# EAGLE schematic PowerSwitchingBoard (EAGLE 9.0.0)

## Sheet 1 of 6: Gimbal Control
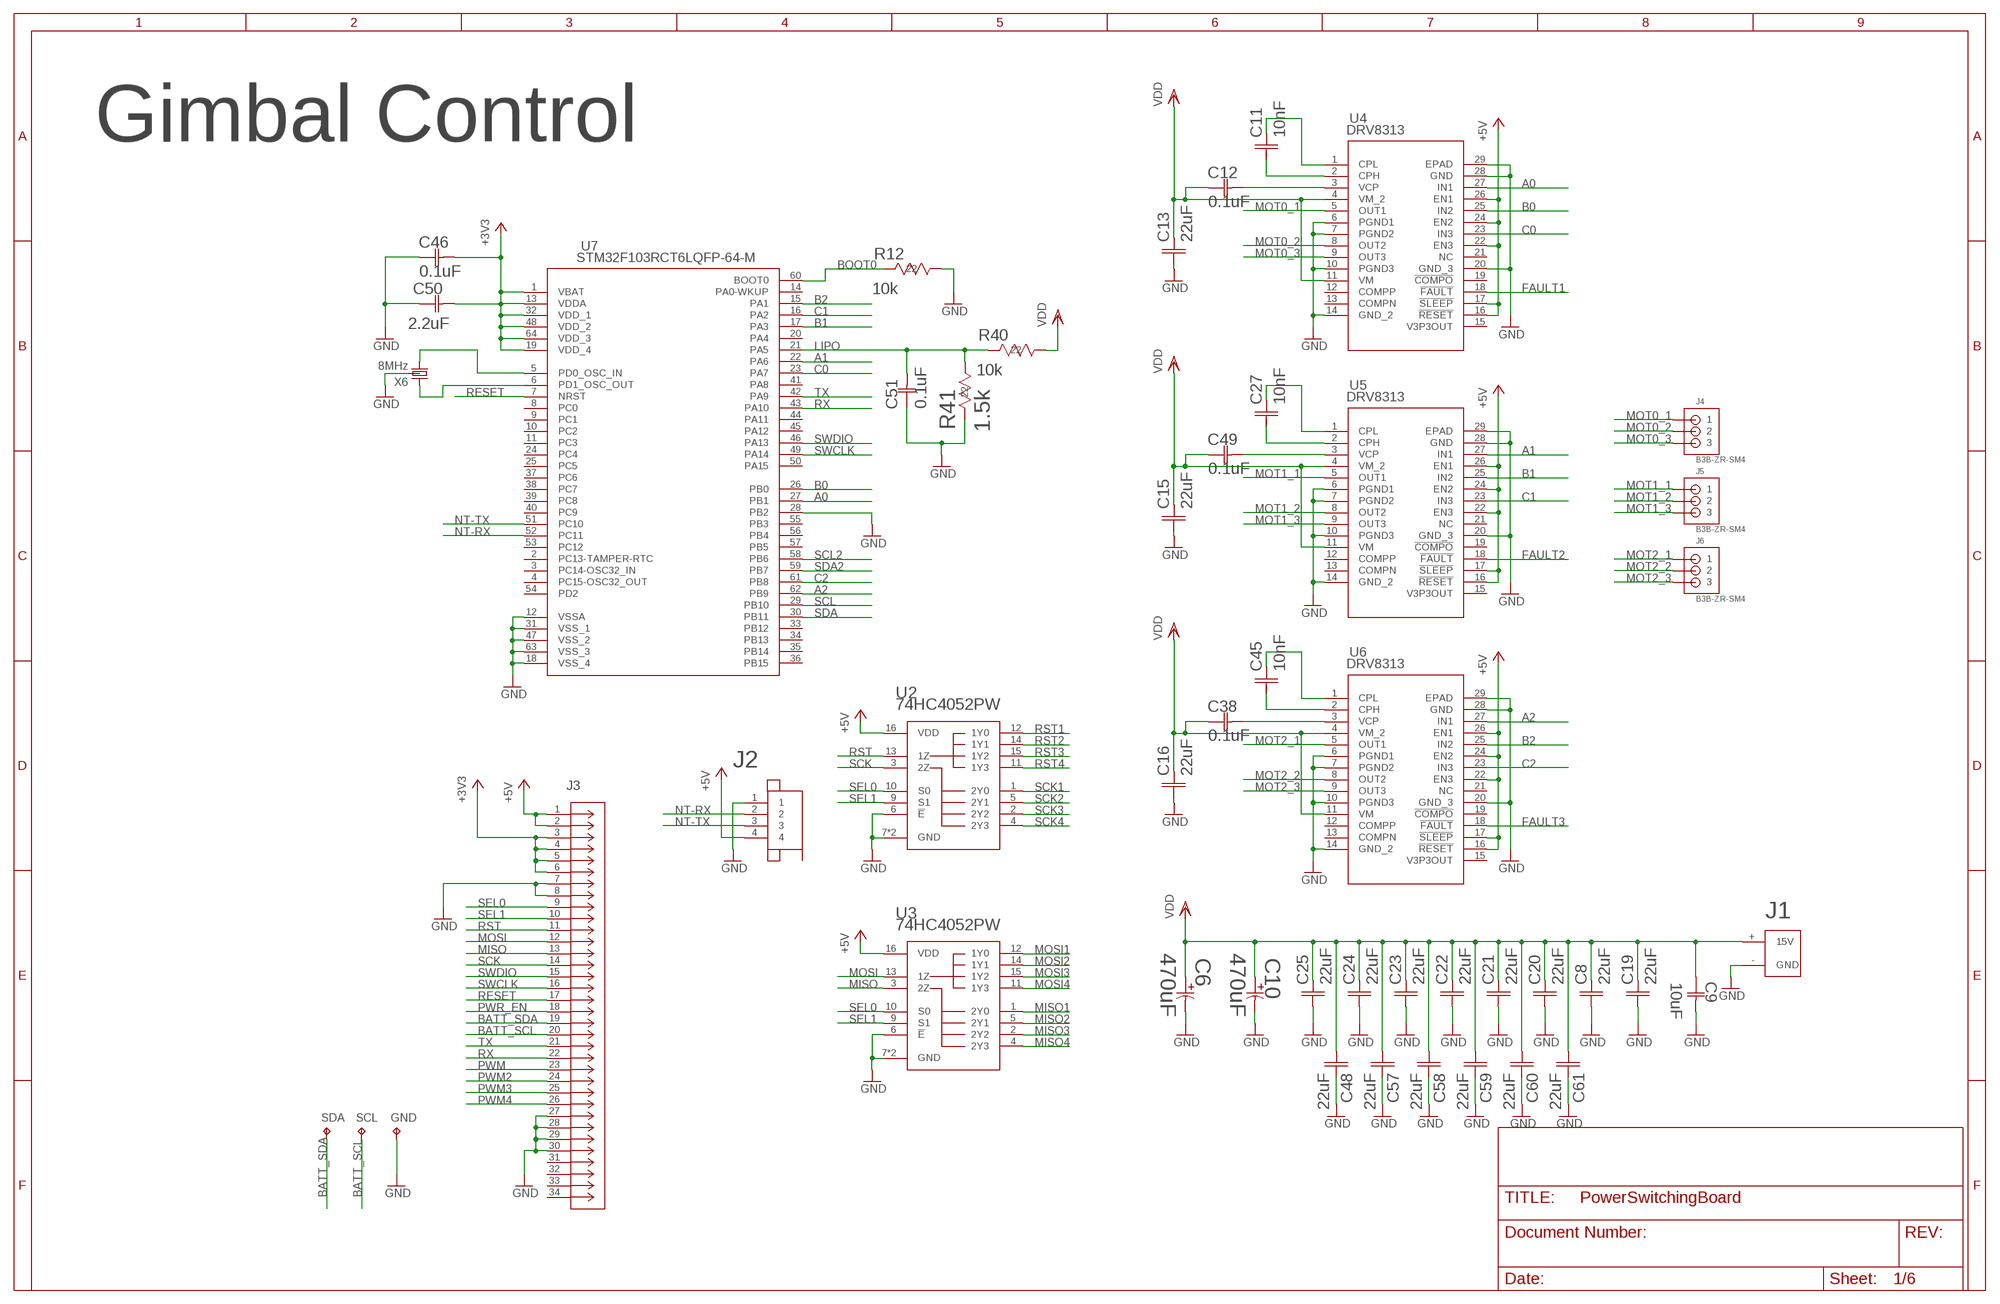
[diagram p0: schematic, sheet 1]

### Parts
C6  470uF  UWT1E471MNL1GSPCAP_10X10-ELECT-M  [PCAP_10X10-ELECT-M]
C8  22uF  CL32A226MAJNNNE  [1210_CAPACITOR]
C9  10uF  GRM21BR60J106ME19L  [G-21]
C10  470uF  UWT1E471MNL1GSPCAP_10X10-ELECT-M  [PCAP_10X10-ELECT-M]
C11  10nF  10NF_CAPACITOR  [0603_CAPACITOR]
C12  0.1uF  0402ZD104KAT2A0402-M  [0402-M]
C13  22uF  CL32A226MAJNNNE  [1210_CAPACITOR]
C15  22uF  CL32A226MAJNNNE  [1210_CAPACITOR]
C16  22uF  CL32A226MAJNNNE  [1210_CAPACITOR]
C19  22uF  CL32A226MAJNNNE  [1210_CAPACITOR]
C20  22uF  CL32A226MAJNNNE  [1210_CAPACITOR]
C21  22uF  CL32A226MAJNNNE  [1210_CAPACITOR]
C22  22uF  CL32A226MAJNNNE  [1210_CAPACITOR]
C23  22uF  CL32A226MAJNNNE  [1210_CAPACITOR]
C24  22uF  CL32A226MAJNNNE  [1210_CAPACITOR]
C25  22uF  CL32A226MAJNNNE  [1210_CAPACITOR]
C27  10nF  10NF_CAPACITOR  [0603_CAPACITOR]
C38  0.1uF  0402ZD104KAT2A0402-M  [0402-M]
C45  10nF  10NF_CAPACITOR  [0603_CAPACITOR]
C46  0.1uF  0402ZD104KAT2A0402-M  [0402-M]
C48  22uF  CL32A226MAJNNNE  [1210_CAPACITOR]
C49  0.1uF  0402ZD104KAT2A0402-M  [0402-M]
C50  2.2uF  GRM188R61C225KE15JG-188-M  [G-188-M]
C51  0.1uF  0402ZD104KAT2A0402-M  [0402-M]
C57  22uF  CL32A226MAJNNNE  [1210_CAPACITOR]
C58  22uF  CL32A226MAJNNNE  [1210_CAPACITOR]
C59  22uF  CL32A226MAJNNNE  [1210_CAPACITOR]
C60  22uF  CL32A226MAJNNNE  [1210_CAPACITOR]
C61  22uF  CL32A226MAJNNNE  [1210_CAPACITOR]
GND  TPTP20SQ  [TP20SQ]
J1  ESC_CONTACTS  [XT60_CONNECTOR]
J2  JST_SH_4POS  [JST_SH_4POS]
J3  62674-301121ALF  [CON30_1X30_DUT_58XF]
J4  B3B-ZR-SM4  [B3B-ZR-SM4]
J5  B3B-ZR-SM4  [B3B-ZR-SM4]
J6  B3B-ZR-SM4  [B3B-ZR-SM4]
R12  10k  RC0603JR-0710KLRC0603N-M  [RC0603N-M]
R40  10k  RC0603JR-0710KLRC0603N-M  [RC0603N-M]
R41  1.5k  RC0603JR-071K5LRC0603N-M  [RC0603N-M]
SCL  TPTP20SQ  [TP20SQ]
SDA  TPTP20SQ  [TP20SQ]
U2  74HC4052PW  [TSSOP16]
U3  74HC4052PW  [TSSOP16]
U4  DRV8313  DRV8313PWPRPWP28_5P18X3P1-M  [PWP28_5P18X3P1-M]
U5  DRV8313  DRV8313PWPRPWP28_5P18X3P1-M  [PWP28_5P18X3P1-M]
U6  DRV8313  DRV8313PWPRPWP28_5P18X3P1-M  [PWP28_5P18X3P1-M]
U7  STM32F103RCT6LQFP-64-M  [LQFP-64-M]
X6  8MHz  CSTCE8M00G55  [3-SMD]

### Nets
+3V3: C46.2 C50.2 J3.3 J3.4 J3.5 J3.6 U7.1(VBAT) U7.13(VDDA) U7.19(VDD_4) U7.32(VDD_1) U7.48(VDD_2) U7.64(VDD_3) ; also sheet 6
+5V: J2.4 J3.1 J3.2 U2.16(VDD) U3.16(VDD) U4.16(!RESET) U4.17(!SLEEP) U4.22(EN3) U4.24(EN2) U4.26(EN1) U5.16(!RESET) U5.17(!SLEEP) U5.22(EN3) U5.24(EN2) U5.26(EN1) U6.16(!RESET) U6.17(!SLEEP) U6.22(EN3) U6.24(EN2) U6.26(EN1) ; also sheet 2,3,4,5,6
A0: U4.27(IN1) U7.27(PB1)
A1: U5.27(IN1) U7.22(PA6)
A2: U6.27(IN1) U7.62(PB9)
B0: U4.25(IN2) U7.26(PB0)
B1: U5.25(IN2) U7.17(PA3)
B2: U6.25(IN2) U7.15(PA1)
BATT_SCL: J3.20 SCL.TP
BATT_SDA: J3.19 SDA.TP
BOOT0: R12.2 U7.60(BOOT0)
C0: U4.23(IN3) U7.23(PA7)
C1: U5.23(IN3) U7.16(PA2)
C2: U6.23(IN3) U7.61(PB8)
FAULT1: U4.18(!FAULT)
FAULT2: U5.18(!FAULT)
FAULT3: U6.18(!FAULT)
GND: C6.2 C8.1 C9.2 C10.2 C13.1 C15.1 C16.1 C19.1 C20.1 C21.1 C22.1 C23.1 C24.1 C25.1 C46.1 C48.2 C50.1 C51.1 C57.2 C58.2 C59.2 C60.2 C61.2 GND.TP J1.-(GND) J2.1 J3.7 J3.8 J3.27 J3.28 J3.29 J3.30 R12.1 R41.2 U2.6(!E) U2.7(GND) U2.8(GND) U3.6(!E) U3.7(GND) U3.8(GND) U4.6(PGND1) U4.7(PGND2) U4.10(PGND3) U4.14(GND_2) U4.20(GND_3) U4.28(GND) U4.29(EPAD) U5.6(PGND1) U5.7(PGND2) U5.10(PGND3) U5.14(GND_2) U5.20(GND_3) U5.28(GND) U5.29(EPAD) U6.6(PGND1) U6.7(PGND2) U6.10(PGND3) U6.14(GND_2) U6.20(GND_3) U6.28(GND) U6.29(EPAD) U7.12(VSSA) U7.18(VSS_4) U7.28(PB2) U7.31(VSS_1) U7.47(VSS_2) U7.63(VSS_3) X6.2(GND) ; also sheet 2,3,4,5,6
LIPO: C51.2 R40.2 R41.1 U7.21(PA5)
MISO: J3.13 U3.3(2Z)
MISO1: U3.1(2Y0) ; also sheet 3
MISO2: U3.5(2Y1) ; also sheet 2
MISO3: U3.2(2Y2) ; also sheet 4
MISO4: U3.4(2Y3) ; also sheet 5
MOSI: J3.12 U3.13(1Z)
MOSI1: U3.12(1Y0) ; also sheet 3
MOSI2: U3.14(1Y1) ; also sheet 2
MOSI3: U3.15(1Y2) ; also sheet 4
MOSI4: U3.11(1Y3) ; also sheet 5
MOT0_1: J4.1 U4.5(OUT1)
MOT0_2: J4.2 U4.8(OUT2)
MOT0_3: J4.3 U4.9(OUT3)
MOT1_1: J5.1 U5.5(OUT1)
MOT1_2: J5.2 U5.8(OUT2)
MOT1_3: J5.3 U5.9(OUT3)
MOT2_1: J6.1 U6.5(OUT1)
MOT2_2: J6.2 U6.8(OUT2)
MOT2_3: J6.3 U6.9(OUT3)
N$1: C11.1 U4.2(CPH)
N$37: C11.2 U4.1(CPL)
N$39: C27.1 U5.2(CPH)
N$40: C27.2 U5.1(CPL)
N$41: C49.2 U5.3(VCP)
N$42: C45.1 U6.2(CPH)
N$43: C45.2 U6.1(CPL)
N$45: C38.2 U6.3(VCP)
N$46: U7.5(PD0_OSC_IN) X6.3
N$47: C12.2 U4.3(VCP)
N$48: U7.6(PD1_OSC_OUT) X6.1
NT-RX: J2.2 U7.52(PC11)
NT-TX: J2.3 U7.51(PC10)
PWM: J3.23 ; also sheet 3
PWM2: J3.24 ; also sheet 2
PWM3: J3.25 ; also sheet 4
PWM4: J3.26 ; also sheet 5
PWR_EN: J3.18 ; also sheet 6
RESET: J3.17 U7.7(NRST)
RST: J3.11 U2.13(1Z)
RST1: U2.12(1Y0) ; also sheet 3
RST2: U2.14(1Y1) ; also sheet 2
RST3: U2.15(1Y2) ; also sheet 4
RST4: U2.11(1Y3) ; also sheet 5
RX: J3.22 U7.43(PA10)
SCK: J3.14 U2.3(2Z)
SCK1: U2.1(2Y0) ; also sheet 3
SCK2: U2.5(2Y1) ; also sheet 2
SCK3: U2.2(2Y2) ; also sheet 4
SCK4: U2.4(2Y3) ; also sheet 5
SCL: U7.29(PB10)
SCL2: U7.58(PB6)
SDA: U7.30(PB11)
SDA2: U7.59(PB7)
SEL0: J3.9 U2.10(S0) U3.10(S0)
SEL1: J3.10 U2.9(S1) U3.9(S1)
SWCLK: J3.16 U7.49(PA14)
SWDIO: J3.15 U7.46(PA13)
TX: J3.21 U7.42(PA9)
VDD: C6.1 C8.2 C9.1 C10.1 C12.1 C13.2 C15.2 C16.2 C19.2 C20.2 C21.2 C22.2 C23.2 C24.2 C25.2 C38.1 C48.1 C49.1 C57.1 C58.1 C59.1 C60.1 C61.1 J1.+(15V) R40.1 U4.4(VM_2) U4.11(VM) U5.4(VM_2) U5.11(VM) U6.4(VM_2) U6.11(VM) ; also sheet 2,3,4,5,6
Unconnected: J2.P$5 J2.P$6 J3.31 J3.32 J3.33 J3.34 U4.12(COMPP) U4.13(COMPN) U4.15(V3P3OUT) U4.19(!COMPO) U4.21(NC) U5.12(COMPP) U5.13(COMPN) U5.15(V3P3OUT) U5.19(!COMPO) U5.21(NC) U6.12(COMPP) U6.13(COMPN) U6.15(V3P3OUT) U6.19(!COMPO) U6.21(NC) U7.2(PC13-TAMPER-RTC) U7.3(PC14-OSC32_IN) U7.4(PC15-OSC32_OUT) U7.8(PC0) U7.9(PC1) U7.10(PC2) U7.11(PC3) U7.14(PA0-WKUP) U7.20(PA4) U7.24(PC4) U7.25(PC5) U7.33(PB12) U7.34(PB13) U7.35(PB14) U7.36(PB15) U7.37(PC6) U7.38(PC7) U7.39(PC8) U7.40(PC9) U7.41(PA8) U7.44(PA11) U7.45(PA12) U7.50(PA15) U7.53(PC12) U7.54(PD2) U7.55(PB3) U7.56(PB4) U7.57(PB5)

### Notes on the sheet
- Gimbal Control

## Sheet 2 of 6
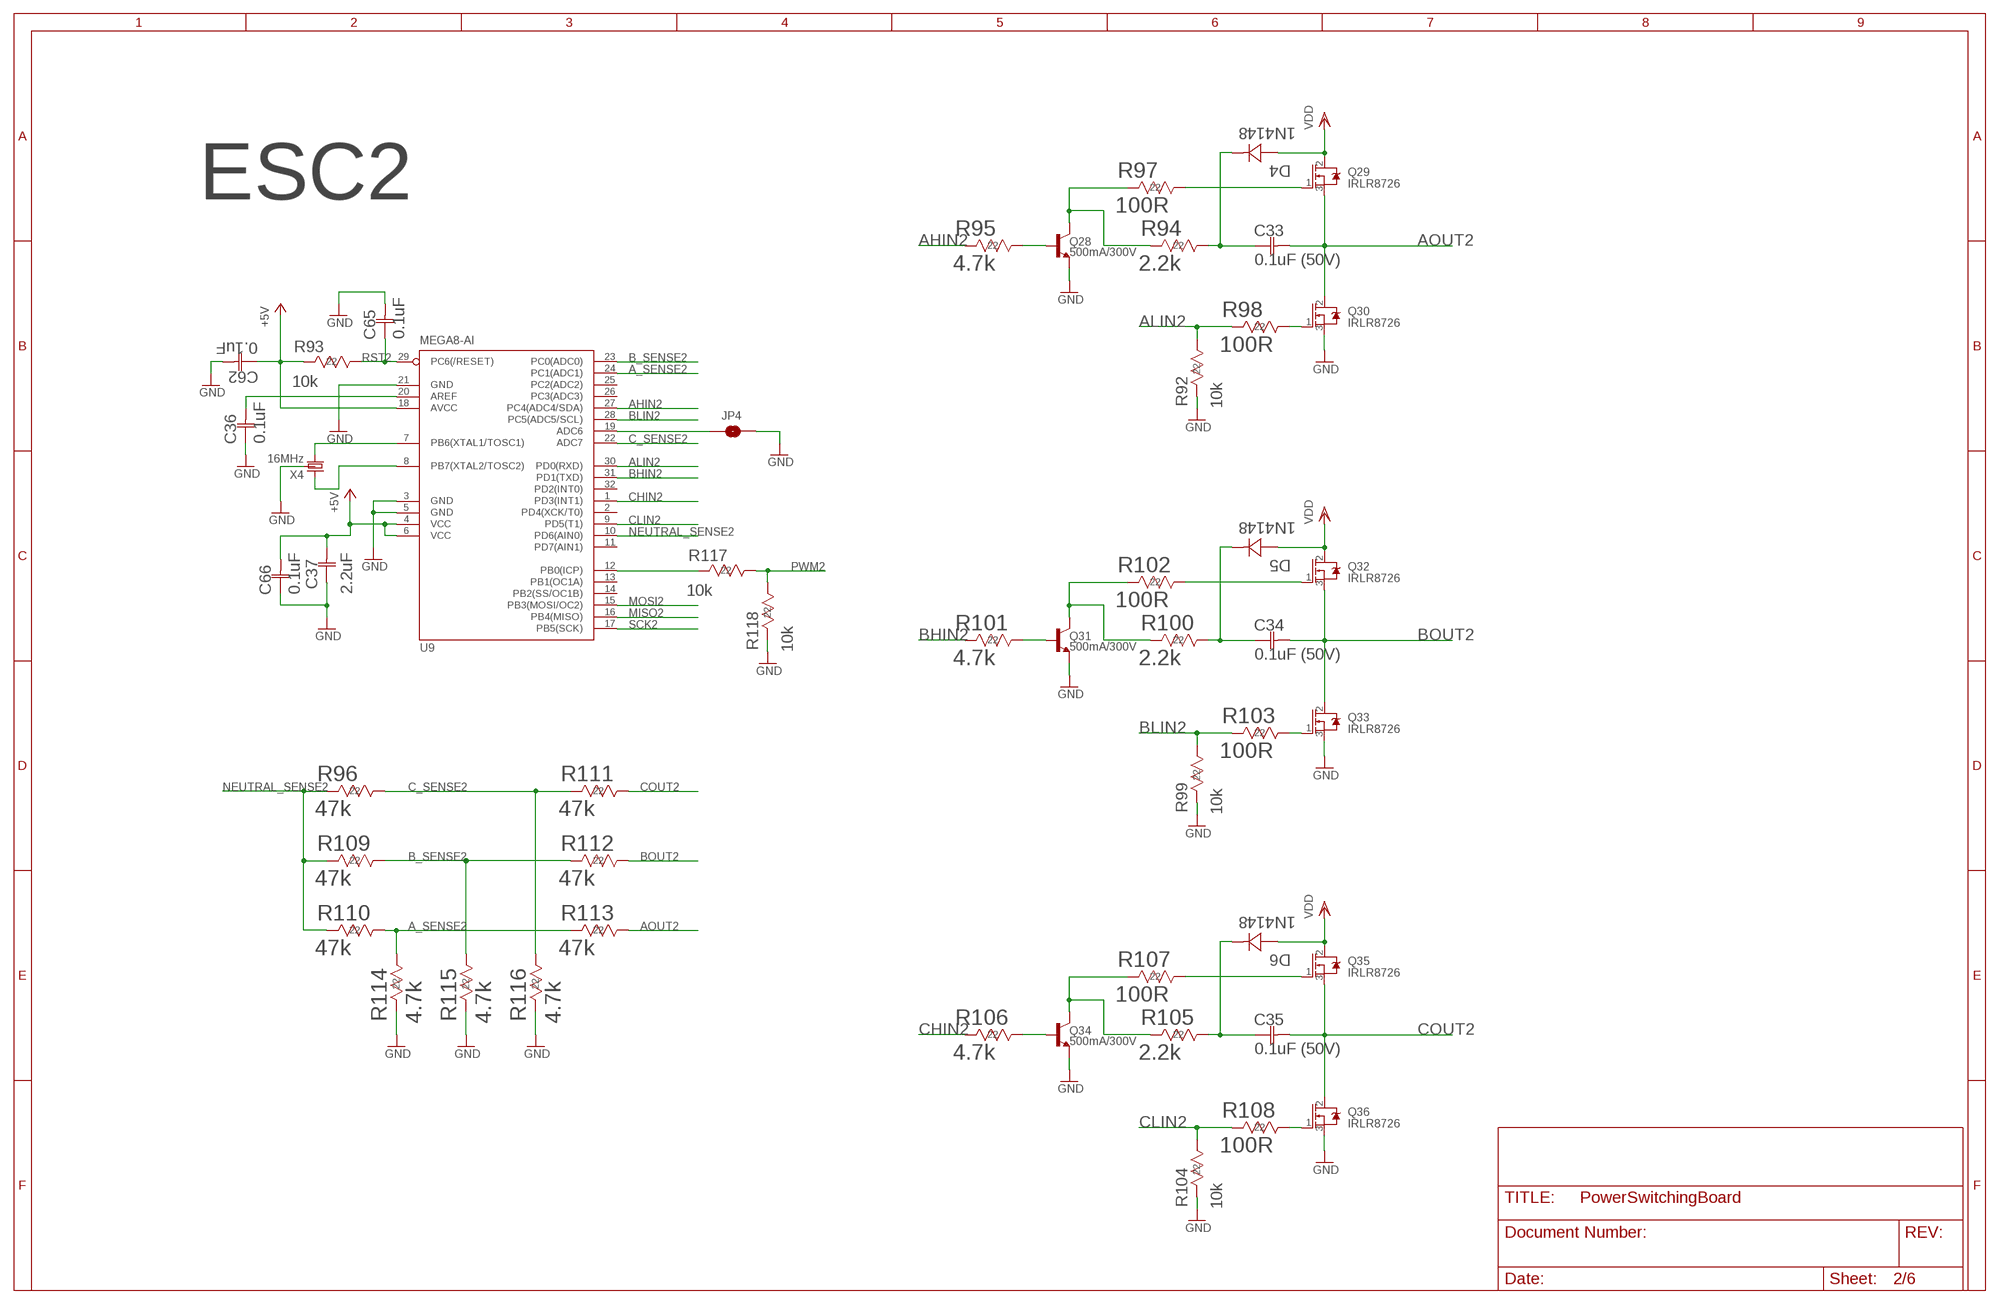
[diagram p1: schematic, sheet 2]

### Parts
C33  0.1uF (50V)  0402ZD104KAT2A0402-M  [0402-M]
C34  0.1uF (50V)  0402ZD104KAT2A0402-M  [0402-M]
C35  0.1uF (50V)  0402ZD104KAT2A0402-M  [0402-M]
C36  0.1uF  0402ZD104KAT2A0402-M  [0402-M]
C37  2.2uF  GRM188R61C225KE15JG-188-M  [G-188-M]
C62  0.1uF  0402ZD104KAT2A0402-M  [0402-M]
C65  0.1uF  0402ZD104KAT2A0402-M  [0402-M]
C66  0.1uF  0402ZD104KAT2A0402-M  [0402-M]
D4  1N4148  1N4148W-7-FSOD123-M  [SOD123-M]
D5  1N4148  1N4148W-7-FSOD123-M  [SOD123-M]
D6  1N4148  1N4148W-7-FSOD123-M  [SOD123-M]
JP4  JUMPER-SMT_2_NO_NO-SILK  [SMT-JUMPER_2_NO_NO-SILK]
Q28  500mA/300V  TRANS_NPN-MMBTA42  [SOT23-3]
Q29  IRLR8726  [DPAK]
Q30  IRLR8726  [DPAK]
Q31  500mA/300V  TRANS_NPN-MMBTA42  [SOT23-3]
Q32  IRLR8726  [DPAK]
Q33  IRLR8726  [DPAK]
Q34  500mA/300V  TRANS_NPN-MMBTA42  [SOT23-3]
Q35  IRLR8726  [DPAK]
Q36  IRLR8726  [DPAK]
R92  10k  RC0603JR-0710KLRC0603N-M  [RC0603N-M]
R93  10k  RC0603JR-0710KLRC0603N-M  [RC0603N-M]
R94  2.2k  RC0603JR-072K2LRC0603N-M  [RC0603N-M]
R95  4.7k  RC0603JR-074K7LRC0603N-M  [RC0603N-M]
R96  47k  RC0603JR-0747KLRC0603N-M  [RC0603N-M]
R97  100R  RC0603JR-07100RLRC0603N-M  [RC0603N-M]
R98  100R  RC0603JR-07100RLRC0603N-M  [RC0603N-M]
R99  10k  RC0603JR-0710KLRC0603N-M  [RC0603N-M]
R100  2.2k  RC0603JR-072K2LRC0603N-M  [RC0603N-M]
R101  4.7k  RC0603JR-074K7LRC0603N-M  [RC0603N-M]
R102  100R  RC0603JR-07100RLRC0603N-M  [RC0603N-M]
R103  100R  RC0603JR-07100RLRC0603N-M  [RC0603N-M]
R104  10k  RC0603JR-0710KLRC0603N-M  [RC0603N-M]
R105  2.2k  RC0603JR-072K2LRC0603N-M  [RC0603N-M]
R106  4.7k  RC0603JR-074K7LRC0603N-M  [RC0603N-M]
R107  100R  RC0603JR-07100RLRC0603N-M  [RC0603N-M]
R108  100R  RC0603JR-07100RLRC0603N-M  [RC0603N-M]
R109  47k  RC0603JR-0747KLRC0603N-M  [RC0603N-M]
R110  47k  RC0603JR-0747KLRC0603N-M  [RC0603N-M]
R111  47k  RC0603JR-0747KLRC0603N-M  [RC0603N-M]
R112  47k  RC0603JR-0747KLRC0603N-M  [RC0603N-M]
R113  47k  RC0603JR-0747KLRC0603N-M  [RC0603N-M]
R114  4.7k  RC0603JR-074K7LRC0603N-M  [RC0603N-M]
R115  4.7k  RC0603JR-074K7LRC0603N-M  [RC0603N-M]
R116  4.7k  RC0603JR-074K7LRC0603N-M  [RC0603N-M]
R117  10k  RC0603JR-0710KLRC0603N-M  [RC0603N-M]
R118  10k  RC0603JR-0710KLRC0603N-M  [RC0603N-M]
U9  MEGA8-AI  [TQFP32-08]
X4  16MHz  CSTCE16  [3-SMD]

### Nets
+5V: C37.2 C62.1 C66.2 R93.2 U9.4(VCC) U9.6(VCC) U9.18(AVCC) ; also sheet 1,3,4,5,6
A_SENSE2: R110.1 R113.2 R114.1 U9.24(PC1(ADC1))
AHIN2: R95.2 U9.27(PC4(ADC4/SDA))
ALIN2: R92.1 R98.2 U9.30(PD0(RXD))
AOUT2: C33.2 Q29.3(S) Q30.2(D) R113.1
B_SENSE2: R109.1 R112.2 R115.1 U9.23(PC0(ADC0))
BHIN2: R101.2 U9.31(PD1(TXD))
BLIN2: R99.1 R103.2 U9.28(PC5(ADC5/SCL))
BOUT2: C34.2 Q32.3(S) Q33.2(D) R112.1
C_SENSE2: R96.1 R111.2 R116.1 U9.22(ADC7)
CHIN2: R106.2 U9.1(PD3(INT1))
CLIN2: R104.1 R108.2 U9.9(PD5(T1))
COUT2: C35.2 Q35.3(S) Q36.2(D) R111.1
GND: C36.1 C37.1 C62.2 C65.2 C66.1 JP4.2 Q28.2(E) Q30.3(S) Q31.2(E) Q33.3(S) Q34.2(E) Q36.3(S) R92.2 R99.2 R104.2 R114.2 R115.2 R116.2 R118.2 U9.3(GND) U9.5(GND) U9.21(GND) X4.2(GND) ; also sheet 1,3,4,5,6
MISO2: U9.16(PB4(MISO)) ; also sheet 1
MOSI2: U9.15(PB3(MOSI/OC2)) ; also sheet 1
N$82: Q28.1(B) R95.1
N$83: Q29.1(G) R97.1
N$84: Q28.3(C) R94.2 R97.2
N$85: C33.1 D4.C R94.1
N$86: Q30.1(G) R98.1
N$87: Q31.1(B) R101.1
N$88: Q32.1(G) R102.1
N$89: Q31.3(C) R100.2 R102.2
N$90: C34.1 D5.C R100.1
N$91: Q33.1(G) R103.1
N$92: Q34.1(B) R106.1
N$93: Q35.1(G) R107.1
N$94: Q34.3(C) R105.2 R107.2
N$95: C35.1 D6.C R105.1
N$96: Q36.1(G) R108.1
N$97: R117.2 U9.12(PB0(ICP))
N$98: JP4.1 U9.19(ADC6)
N$99: C36.2 U9.20(AREF)
N$100: U9.7(PB6(XTAL1/TOSC1)) X4.3
N$101: U9.8(PB7(XTAL2/TOSC2)) X4.1
NEUTRAL_SENSE2: R96.2 R109.2 R110.2 U9.10(PD6(AIN0))
PWM2: R117.1 R118.1 ; also sheet 1
RST2: C65.1 R93.1 U9.29(PC6(/RESET)) ; also sheet 1
SCK2: U9.17(PB5(SCK)) ; also sheet 1
VDD: D4.A D5.A D6.A Q29.2(D) Q32.2(D) Q35.2(D) ; also sheet 1,3,4,5,6
Unconnected: U9.2(PD4(XCK/T0)) U9.11(PD7(AIN1)) U9.13(PB1(OC1A)) U9.14(PB2(SS/OC1B)) U9.25(PC2(ADC2)) U9.26(PC3(ADC3)) U9.32(PD2(INT0))

### Notes on the sheet
- ESC2

## Sheet 3 of 6
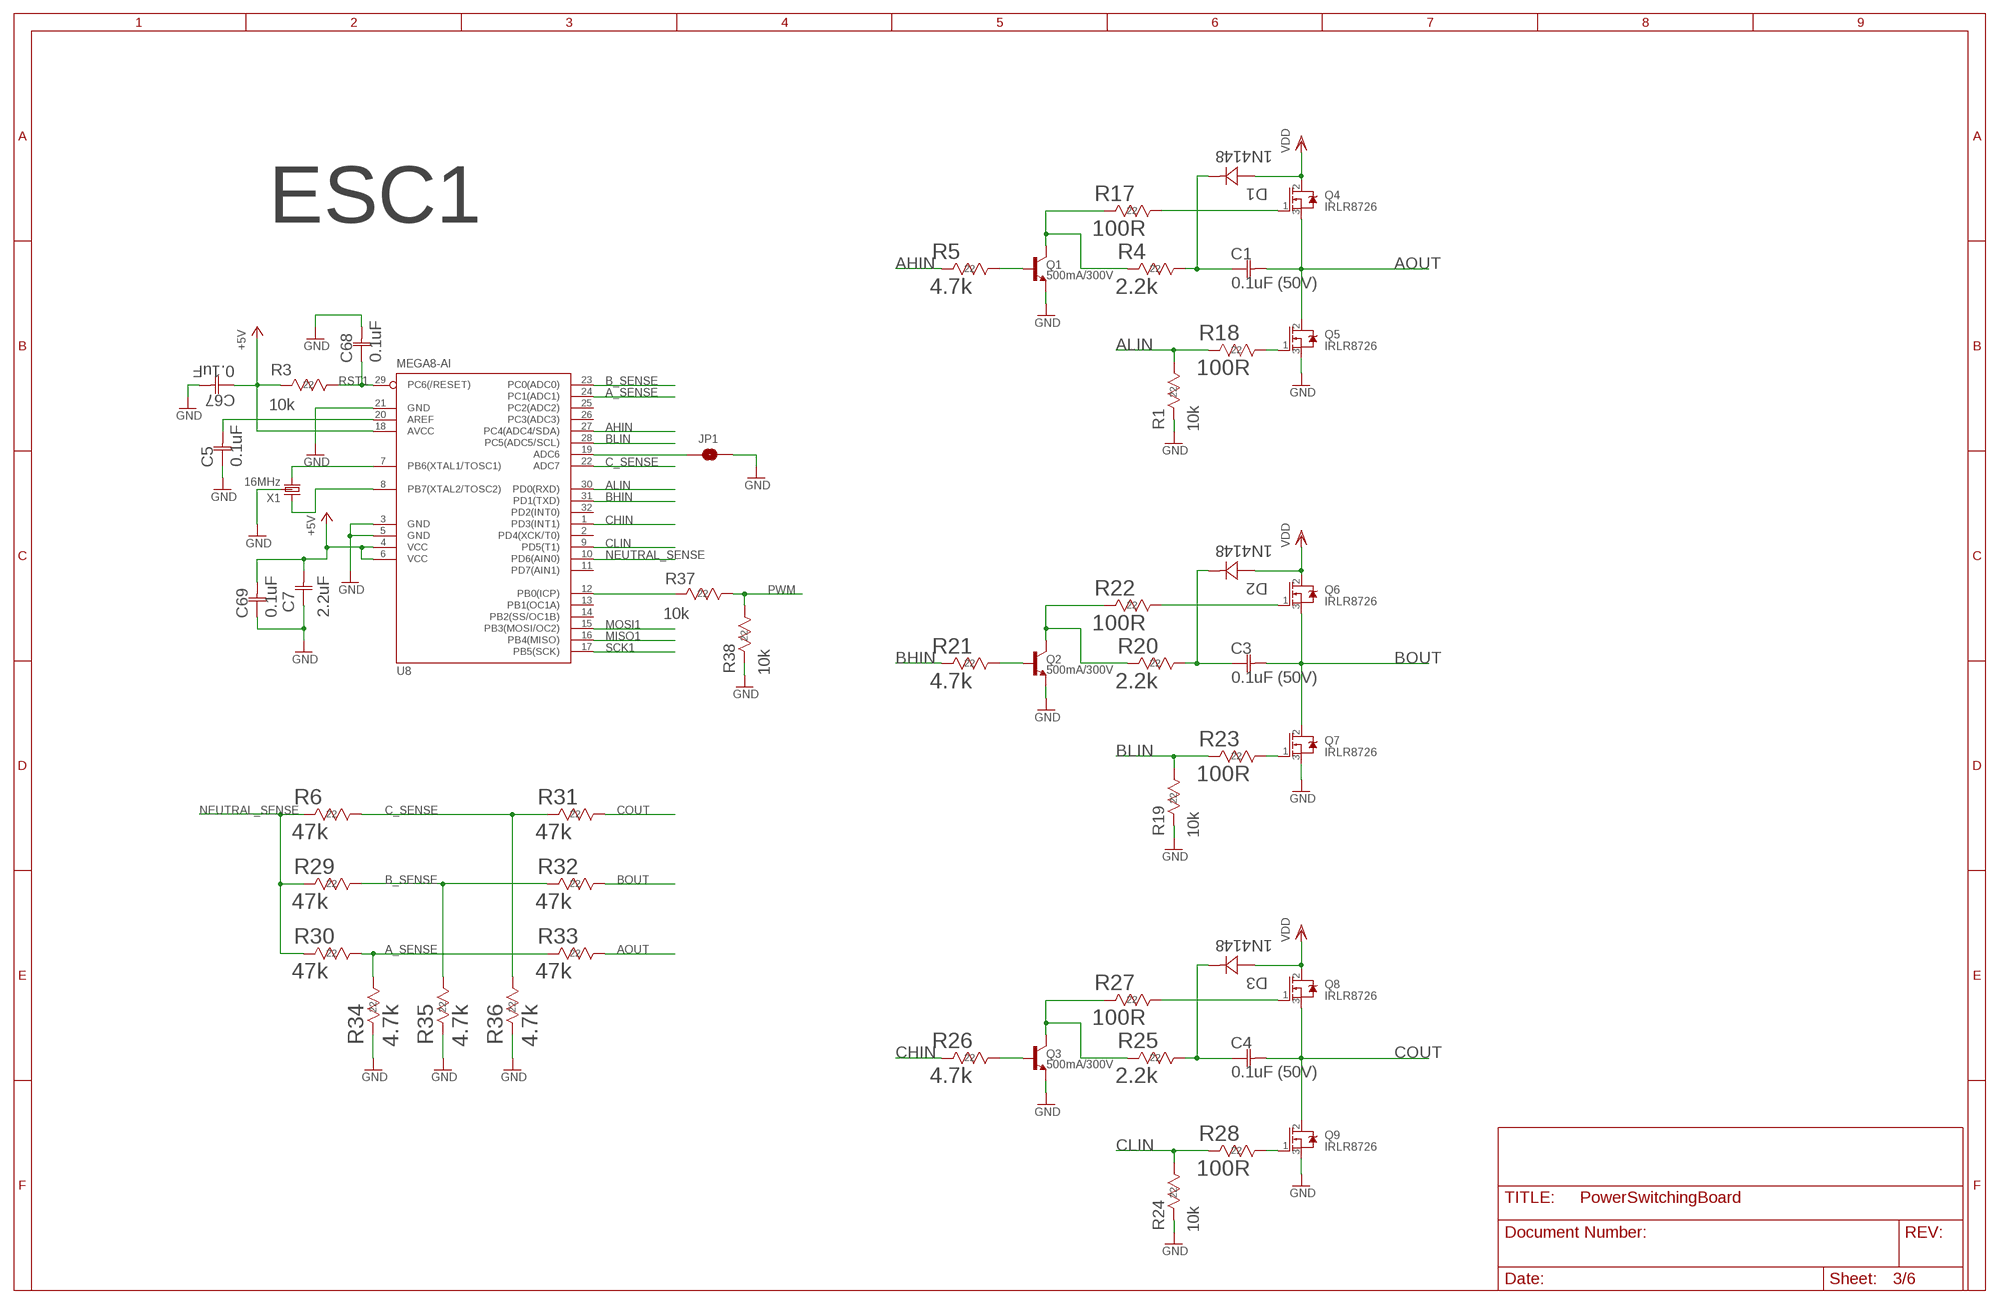
[diagram p2: schematic, sheet 3]

### Parts
C1  0.1uF (50V)  0402ZD104KAT2A0402-M  [0402-M]
C3  0.1uF (50V)  0402ZD104KAT2A0402-M  [0402-M]
C4  0.1uF (50V)  0402ZD104KAT2A0402-M  [0402-M]
C5  0.1uF  0402ZD104KAT2A0402-M  [0402-M]
C7  2.2uF  GRM188R61C225KE15JG-188-M  [G-188-M]
C67  0.1uF  0402ZD104KAT2A0402-M  [0402-M]
C68  0.1uF  0402ZD104KAT2A0402-M  [0402-M]
C69  0.1uF  0402ZD104KAT2A0402-M  [0402-M]
D1  1N4148  1N4148W-7-FSOD123-M  [SOD123-M]
D2  1N4148  1N4148W-7-FSOD123-M  [SOD123-M]
D3  1N4148  1N4148W-7-FSOD123-M  [SOD123-M]
JP1  JUMPER-SMT_2_NO_NO-SILK  [SMT-JUMPER_2_NO_NO-SILK]
Q1  500mA/300V  TRANS_NPN-MMBTA42  [SOT23-3]
Q2  500mA/300V  TRANS_NPN-MMBTA42  [SOT23-3]
Q3  500mA/300V  TRANS_NPN-MMBTA42  [SOT23-3]
Q4  IRLR8726  [DPAK]
Q5  IRLR8726  [DPAK]
Q6  IRLR8726  [DPAK]
Q7  IRLR8726  [DPAK]
Q8  IRLR8726  [DPAK]
Q9  IRLR8726  [DPAK]
R1  10k  RC0603JR-0710KLRC0603N-M  [RC0603N-M]
R3  10k  RC0603JR-0710KLRC0603N-M  [RC0603N-M]
R4  2.2k  RC0603JR-072K2LRC0603N-M  [RC0603N-M]
R5  4.7k  RC0603JR-074K7LRC0603N-M  [RC0603N-M]
R6  47k  RC0603JR-0747KLRC0603N-M  [RC0603N-M]
R17  100R  RC0603JR-07100RLRC0603N-M  [RC0603N-M]
R18  100R  RC0603JR-07100RLRC0603N-M  [RC0603N-M]
R19  10k  RC0603JR-0710KLRC0603N-M  [RC0603N-M]
R20  2.2k  RC0603JR-072K2LRC0603N-M  [RC0603N-M]
R21  4.7k  RC0603JR-074K7LRC0603N-M  [RC0603N-M]
R22  100R  RC0603JR-07100RLRC0603N-M  [RC0603N-M]
R23  100R  RC0603JR-07100RLRC0603N-M  [RC0603N-M]
R24  10k  RC0603JR-0710KLRC0603N-M  [RC0603N-M]
R25  2.2k  RC0603JR-072K2LRC0603N-M  [RC0603N-M]
R26  4.7k  RC0603JR-074K7LRC0603N-M  [RC0603N-M]
R27  100R  RC0603JR-07100RLRC0603N-M  [RC0603N-M]
R28  100R  RC0603JR-07100RLRC0603N-M  [RC0603N-M]
R29  47k  RC0603JR-0747KLRC0603N-M  [RC0603N-M]
R30  47k  RC0603JR-0747KLRC0603N-M  [RC0603N-M]
R31  47k  RC0603JR-0747KLRC0603N-M  [RC0603N-M]
R32  47k  RC0603JR-0747KLRC0603N-M  [RC0603N-M]
R33  47k  RC0603JR-0747KLRC0603N-M  [RC0603N-M]
R34  4.7k  RC0603JR-074K7LRC0603N-M  [RC0603N-M]
R35  4.7k  RC0603JR-074K7LRC0603N-M  [RC0603N-M]
R36  4.7k  RC0603JR-074K7LRC0603N-M  [RC0603N-M]
R37  10k  RC0603JR-0710KLRC0603N-M  [RC0603N-M]
R38  10k  RC0603JR-0710KLRC0603N-M  [RC0603N-M]
U8  MEGA8-AI  [TQFP32-08]
X1  16MHz  CSTCE16  [3-SMD]

### Nets
+5V: C7.2 C67.1 C69.2 R3.2 U8.4(VCC) U8.6(VCC) U8.18(AVCC) ; also sheet 1,2,4,5,6
A_SENSE: R30.1 R33.2 R34.1 U8.24(PC1(ADC1))
AHIN: R5.2 U8.27(PC4(ADC4/SDA))
ALIN: R1.1 R18.2 U8.30(PD0(RXD))
AOUT: C1.2 Q4.3(S) Q5.2(D) R33.1
B_SENSE: R29.1 R32.2 R35.1 U8.23(PC0(ADC0))
BHIN: R21.2 U8.31(PD1(TXD))
BLIN: R19.1 R23.2 U8.28(PC5(ADC5/SCL))
BOUT: C3.2 Q6.3(S) Q7.2(D) R32.1
C_SENSE: R6.1 R31.2 R36.1 U8.22(ADC7)
CHIN: R26.2 U8.1(PD3(INT1))
CLIN: R24.1 R28.2 U8.9(PD5(T1))
COUT: C4.2 Q8.3(S) Q9.2(D) R31.1
GND: C5.1 C7.1 C67.2 C68.2 C69.1 JP1.2 Q1.2(E) Q2.2(E) Q3.2(E) Q5.3(S) Q7.3(S) Q9.3(S) R1.2 R19.2 R24.2 R34.2 R35.2 R36.2 R38.2 U8.3(GND) U8.5(GND) U8.21(GND) X1.2(GND) ; also sheet 1,2,4,5,6
MISO1: U8.16(PB4(MISO)) ; also sheet 1
MOSI1: U8.15(PB3(MOSI/OC2)) ; also sheet 1
N$4: Q1.1(B) R5.1
N$5: Q4.1(G) R17.1
N$6: Q1.3(C) R4.2 R17.2
N$7: Q2.1(B) R21.1
N$8: C1.1 D1.C R4.1
N$9: Q5.1(G) R18.1
N$10: Q6.1(G) R22.1
N$21: Q2.3(C) R20.2 R22.2
N$22: C3.1 D2.C R20.1
N$24: Q7.1(G) R23.1
N$25: Q3.1(B) R26.1
N$30: Q8.1(G) R27.1
N$31: Q3.3(C) R25.2 R27.2
N$32: C4.1 D3.C R25.1
N$33: Q9.1(G) R28.1
N$34: C5.2 U8.20(AREF)
N$35: U8.7(PB6(XTAL1/TOSC1)) X1.3
N$36: U8.8(PB7(XTAL2/TOSC2)) X1.1
N$38: JP1.1 U8.19(ADC6)
N$44: R37.2 U8.12(PB0(ICP))
NEUTRAL_SENSE: R6.2 R29.2 R30.2 U8.10(PD6(AIN0))
PWM: R37.1 R38.1 ; also sheet 1
RST1: C68.1 R3.1 U8.29(PC6(/RESET)) ; also sheet 1
SCK1: U8.17(PB5(SCK)) ; also sheet 1
VDD: D1.A D2.A D3.A Q4.2(D) Q6.2(D) Q8.2(D) ; also sheet 1,2,4,5,6
Unconnected: U8.2(PD4(XCK/T0)) U8.11(PD7(AIN1)) U8.13(PB1(OC1A)) U8.14(PB2(SS/OC1B)) U8.25(PC2(ADC2)) U8.26(PC3(ADC3)) U8.32(PD2(INT0))

### Notes on the sheet
- ESC1

## Sheet 4 of 6
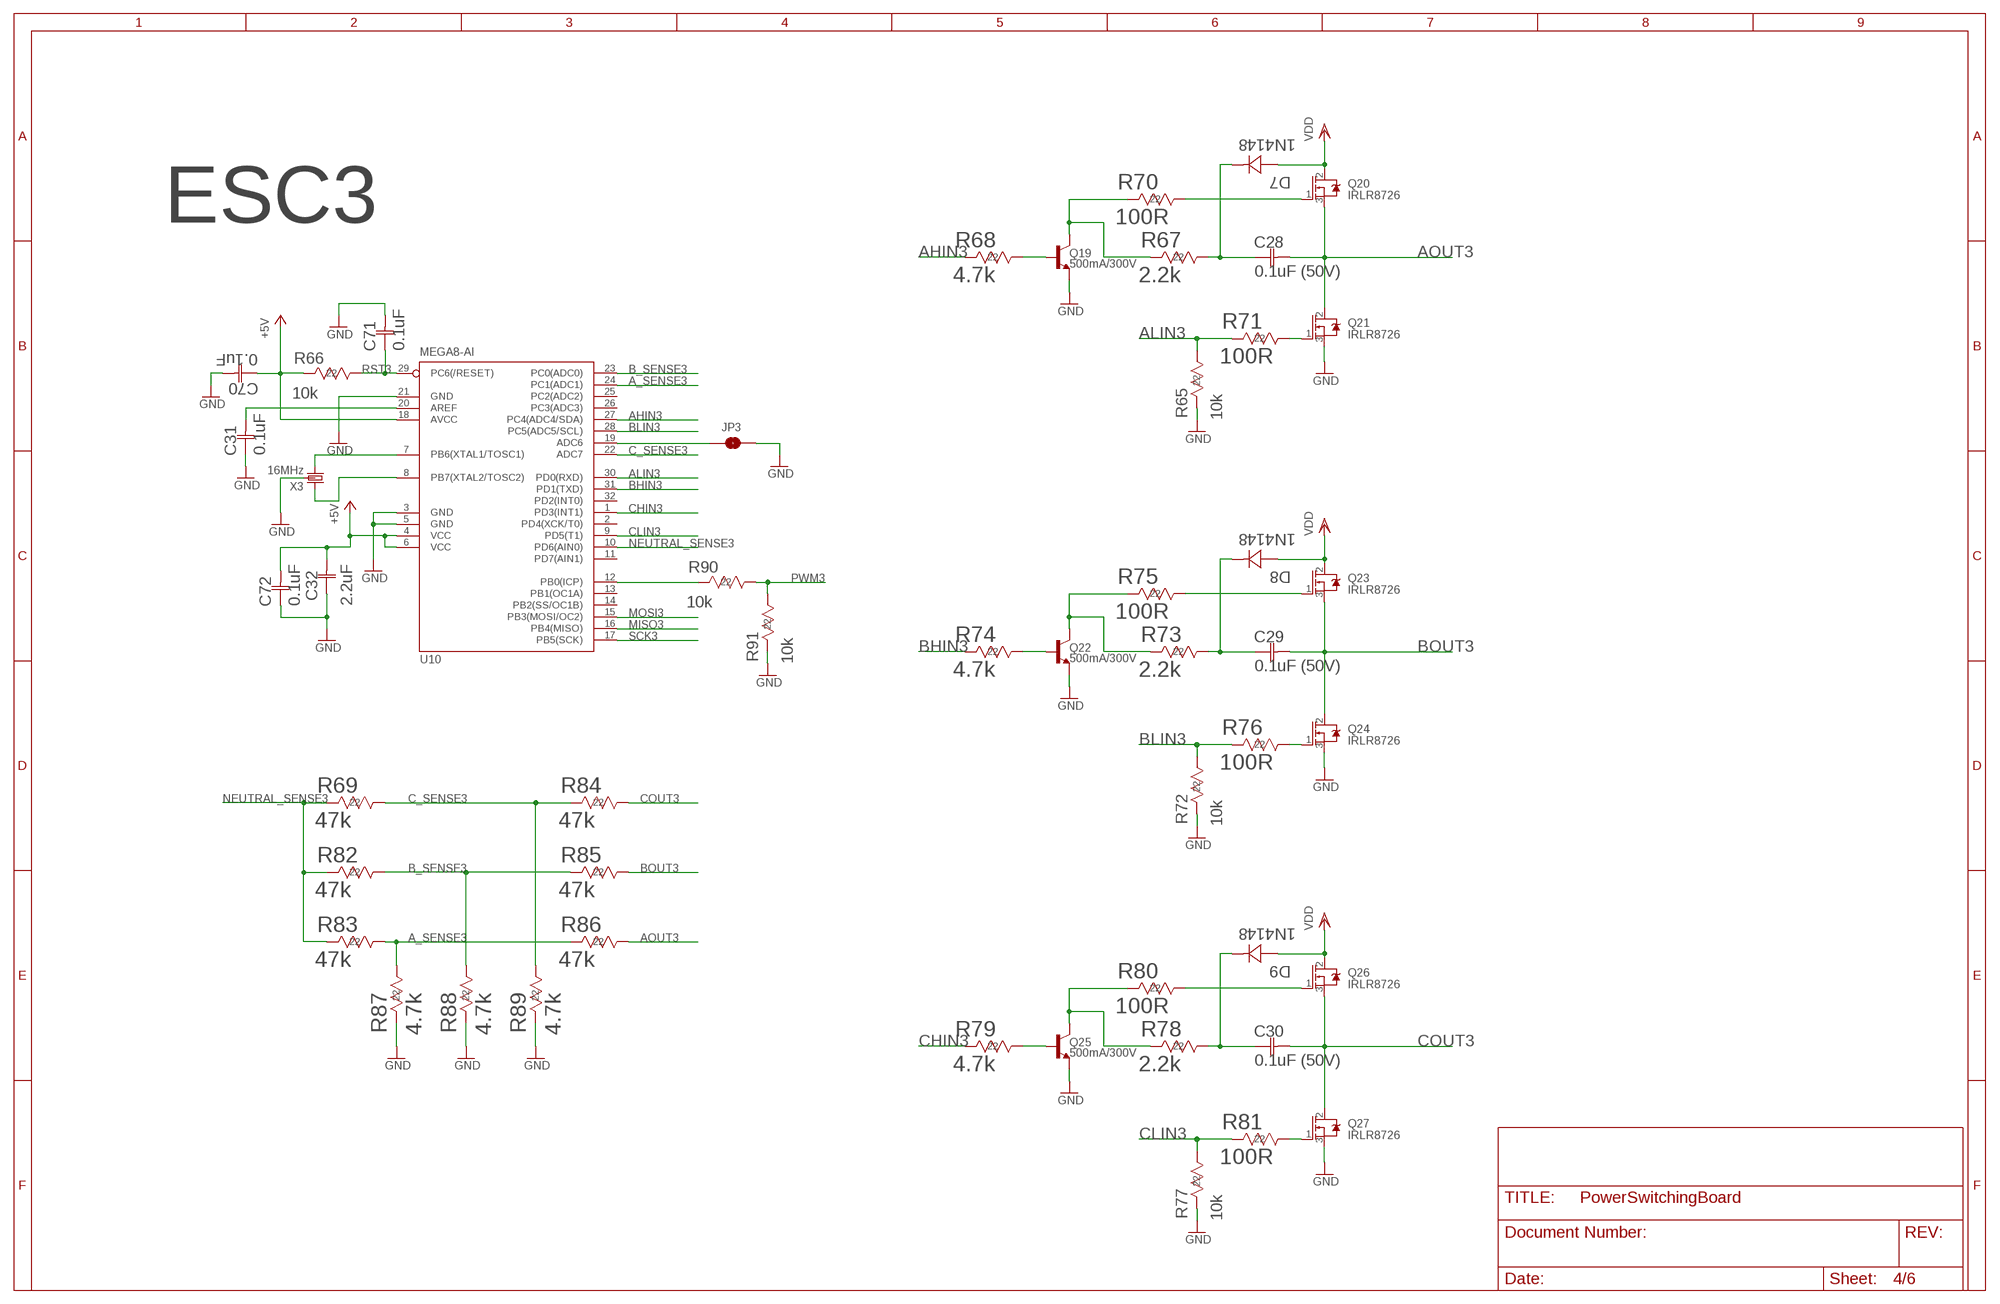
[diagram p3: schematic, sheet 4]

### Parts
C28  0.1uF (50V)  0402ZD104KAT2A0402-M  [0402-M]
C29  0.1uF (50V)  0402ZD104KAT2A0402-M  [0402-M]
C30  0.1uF (50V)  0402ZD104KAT2A0402-M  [0402-M]
C31  0.1uF  0402ZD104KAT2A0402-M  [0402-M]
C32  2.2uF  GRM188R61C225KE15JG-188-M  [G-188-M]
C70  0.1uF  0402ZD104KAT2A0402-M  [0402-M]
C71  0.1uF  0402ZD104KAT2A0402-M  [0402-M]
C72  0.1uF  0402ZD104KAT2A0402-M  [0402-M]
D7  1N4148  1N4148W-7-FSOD123-M  [SOD123-M]
D8  1N4148  1N4148W-7-FSOD123-M  [SOD123-M]
D9  1N4148  1N4148W-7-FSOD123-M  [SOD123-M]
JP3  JUMPER-SMT_2_NO_NO-SILK  [SMT-JUMPER_2_NO_NO-SILK]
Q19  500mA/300V  TRANS_NPN-MMBTA42  [SOT23-3]
Q20  IRLR8726  [DPAK]
Q21  IRLR8726  [DPAK]
Q22  500mA/300V  TRANS_NPN-MMBTA42  [SOT23-3]
Q23  IRLR8726  [DPAK]
Q24  IRLR8726  [DPAK]
Q25  500mA/300V  TRANS_NPN-MMBTA42  [SOT23-3]
Q26  IRLR8726  [DPAK]
Q27  IRLR8726  [DPAK]
R65  10k  RC0603JR-0710KLRC0603N-M  [RC0603N-M]
R66  10k  RC0603JR-0710KLRC0603N-M  [RC0603N-M]
R67  2.2k  RC0603JR-072K2LRC0603N-M  [RC0603N-M]
R68  4.7k  RC0603JR-074K7LRC0603N-M  [RC0603N-M]
R69  47k  RC0603JR-0747KLRC0603N-M  [RC0603N-M]
R70  100R  RC0603JR-07100RLRC0603N-M  [RC0603N-M]
R71  100R  RC0603JR-07100RLRC0603N-M  [RC0603N-M]
R72  10k  RC0603JR-0710KLRC0603N-M  [RC0603N-M]
R73  2.2k  RC0603JR-072K2LRC0603N-M  [RC0603N-M]
R74  4.7k  RC0603JR-074K7LRC0603N-M  [RC0603N-M]
R75  100R  RC0603JR-07100RLRC0603N-M  [RC0603N-M]
R76  100R  RC0603JR-07100RLRC0603N-M  [RC0603N-M]
R77  10k  RC0603JR-0710KLRC0603N-M  [RC0603N-M]
R78  2.2k  RC0603JR-072K2LRC0603N-M  [RC0603N-M]
R79  4.7k  RC0603JR-074K7LRC0603N-M  [RC0603N-M]
R80  100R  RC0603JR-07100RLRC0603N-M  [RC0603N-M]
R81  100R  RC0603JR-07100RLRC0603N-M  [RC0603N-M]
R82  47k  RC0603JR-0747KLRC0603N-M  [RC0603N-M]
R83  47k  RC0603JR-0747KLRC0603N-M  [RC0603N-M]
R84  47k  RC0603JR-0747KLRC0603N-M  [RC0603N-M]
R85  47k  RC0603JR-0747KLRC0603N-M  [RC0603N-M]
R86  47k  RC0603JR-0747KLRC0603N-M  [RC0603N-M]
R87  4.7k  RC0603JR-074K7LRC0603N-M  [RC0603N-M]
R88  4.7k  RC0603JR-074K7LRC0603N-M  [RC0603N-M]
R89  4.7k  RC0603JR-074K7LRC0603N-M  [RC0603N-M]
R90  10k  RC0603JR-0710KLRC0603N-M  [RC0603N-M]
R91  10k  RC0603JR-0710KLRC0603N-M  [RC0603N-M]
U10  MEGA8-AI  [TQFP32-08]
X3  16MHz  CSTCE16  [3-SMD]

### Nets
+5V: C32.2 C70.1 C72.2 R66.2 U10.4(VCC) U10.6(VCC) U10.18(AVCC) ; also sheet 1,2,3,5,6
A_SENSE3: R83.1 R86.2 R87.1 U10.24(PC1(ADC1))
AHIN3: R68.2 U10.27(PC4(ADC4/SDA))
ALIN3: R65.1 R71.2 U10.30(PD0(RXD))
AOUT3: C28.2 Q20.3(S) Q21.2(D) R86.1
B_SENSE3: R82.1 R85.2 R88.1 U10.23(PC0(ADC0))
BHIN3: R74.2 U10.31(PD1(TXD))
BLIN3: R72.1 R76.2 U10.28(PC5(ADC5/SCL))
BOUT3: C29.2 Q23.3(S) Q24.2(D) R85.1
C_SENSE3: R69.1 R84.2 R89.1 U10.22(ADC7)
CHIN3: R79.2 U10.1(PD3(INT1))
CLIN3: R77.1 R81.2 U10.9(PD5(T1))
COUT3: C30.2 Q26.3(S) Q27.2(D) R84.1
GND: C31.1 C32.1 C70.2 C71.2 C72.1 JP3.2 Q19.2(E) Q21.3(S) Q22.2(E) Q24.3(S) Q25.2(E) Q27.3(S) R65.2 R72.2 R77.2 R87.2 R88.2 R89.2 R91.2 U10.3(GND) U10.5(GND) U10.21(GND) X3.2(GND) ; also sheet 1,2,3,5,6
MISO3: U10.16(PB4(MISO)) ; also sheet 1
MOSI3: U10.15(PB3(MOSI/OC2)) ; also sheet 1
N$61: Q19.1(B) R68.1
N$62: Q20.1(G) R70.1
N$63: Q19.3(C) R67.2 R70.2
N$64: C28.1 D7.C R67.1
N$65: Q21.1(G) R71.1
N$66: Q22.1(B) R74.1
N$67: Q23.1(G) R75.1
N$68: Q22.3(C) R73.2 R75.2
N$69: C29.1 D8.C R73.1
N$70: Q24.1(G) R76.1
N$71: Q25.1(B) R79.1
N$72: Q26.1(G) R80.1
N$73: Q25.3(C) R78.2 R80.2
N$74: C30.1 D9.C R78.1
N$75: Q27.1(G) R81.1
N$76: R90.2 U10.12(PB0(ICP))
N$77: JP3.1 U10.19(ADC6)
N$78: C31.2 U10.20(AREF)
N$79: U10.7(PB6(XTAL1/TOSC1)) X3.3
N$80: U10.8(PB7(XTAL2/TOSC2)) X3.1
NEUTRAL_SENSE3: R69.2 R82.2 R83.2 U10.10(PD6(AIN0))
PWM3: R90.1 R91.1 ; also sheet 1
RST3: C71.1 R66.1 U10.29(PC6(/RESET)) ; also sheet 1
SCK3: U10.17(PB5(SCK)) ; also sheet 1
VDD: D7.A D8.A D9.A Q20.2(D) Q23.2(D) Q26.2(D) ; also sheet 1,2,3,5,6
Unconnected: U10.2(PD4(XCK/T0)) U10.11(PD7(AIN1)) U10.13(PB1(OC1A)) U10.14(PB2(SS/OC1B)) U10.25(PC2(ADC2)) U10.26(PC3(ADC3)) U10.32(PD2(INT0))

### Notes on the sheet
- ESC3

## Sheet 5 of 6
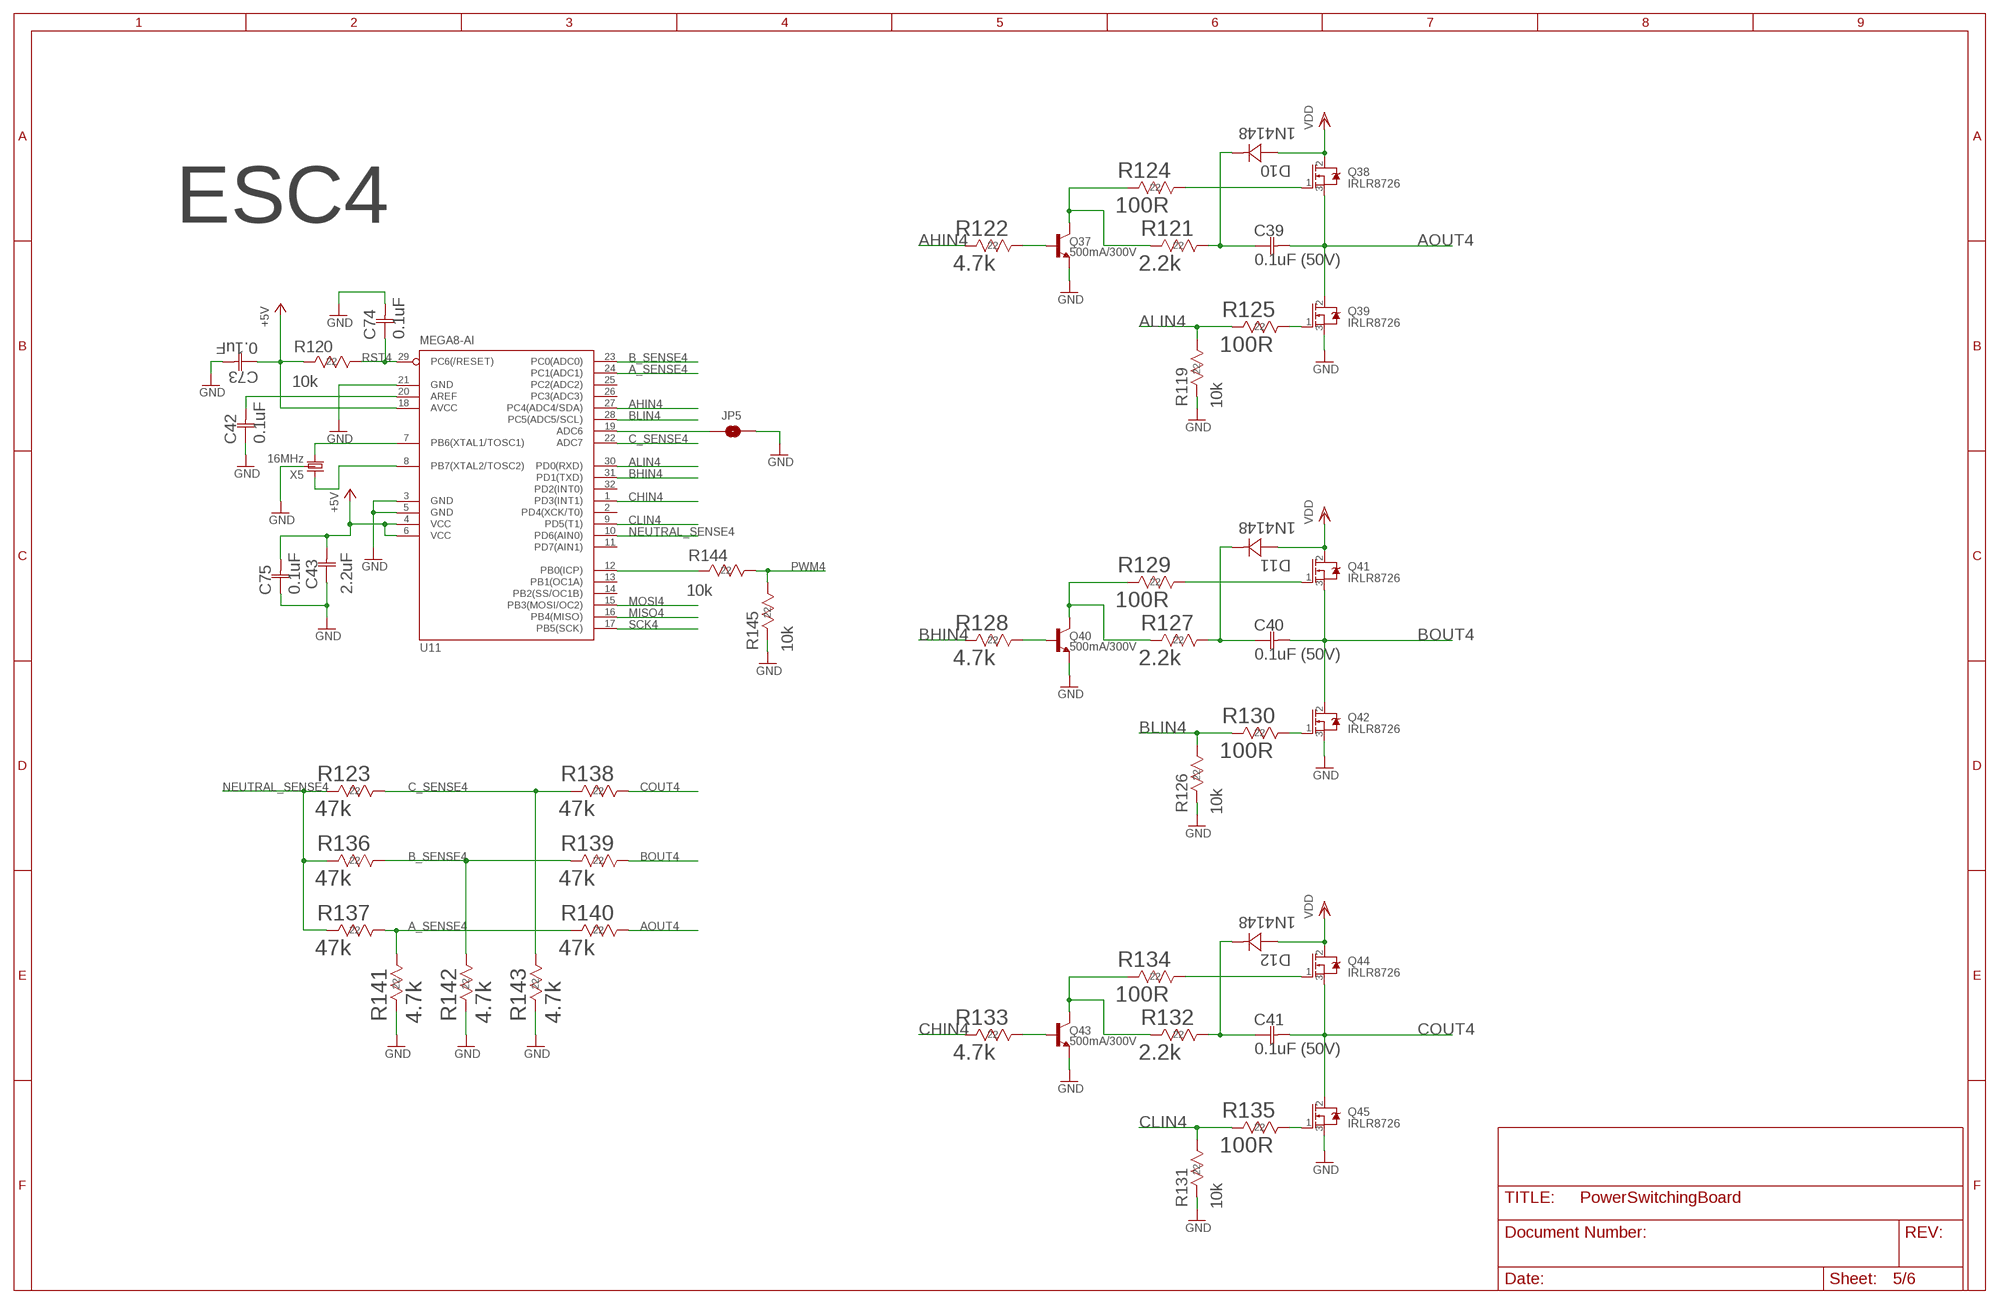
[diagram p4: schematic, sheet 5]

### Parts
C39  0.1uF (50V)  0402ZD104KAT2A0402-M  [0402-M]
C40  0.1uF (50V)  0402ZD104KAT2A0402-M  [0402-M]
C41  0.1uF (50V)  0402ZD104KAT2A0402-M  [0402-M]
C42  0.1uF  0402ZD104KAT2A0402-M  [0402-M]
C43  2.2uF  GRM188R61C225KE15JG-188-M  [G-188-M]
C73  0.1uF  0402ZD104KAT2A0402-M  [0402-M]
C74  0.1uF  0402ZD104KAT2A0402-M  [0402-M]
C75  0.1uF  0402ZD104KAT2A0402-M  [0402-M]
D10  1N4148  1N4148W-7-FSOD123-M  [SOD123-M]
D11  1N4148  1N4148W-7-FSOD123-M  [SOD123-M]
D12  1N4148  1N4148W-7-FSOD123-M  [SOD123-M]
JP5  JUMPER-SMT_2_NO_NO-SILK  [SMT-JUMPER_2_NO_NO-SILK]
Q37  500mA/300V  TRANS_NPN-MMBTA42  [SOT23-3]
Q38  IRLR8726  [DPAK]
Q39  IRLR8726  [DPAK]
Q40  500mA/300V  TRANS_NPN-MMBTA42  [SOT23-3]
Q41  IRLR8726  [DPAK]
Q42  IRLR8726  [DPAK]
Q43  500mA/300V  TRANS_NPN-MMBTA42  [SOT23-3]
Q44  IRLR8726  [DPAK]
Q45  IRLR8726  [DPAK]
R119  10k  RC0603JR-0710KLRC0603N-M  [RC0603N-M]
R120  10k  RC0603JR-0710KLRC0603N-M  [RC0603N-M]
R121  2.2k  RC0603JR-072K2LRC0603N-M  [RC0603N-M]
R122  4.7k  RC0603JR-074K7LRC0603N-M  [RC0603N-M]
R123  47k  RC0603JR-0747KLRC0603N-M  [RC0603N-M]
R124  100R  RC0603JR-07100RLRC0603N-M  [RC0603N-M]
R125  100R  RC0603JR-07100RLRC0603N-M  [RC0603N-M]
R126  10k  RC0603JR-0710KLRC0603N-M  [RC0603N-M]
R127  2.2k  RC0603JR-072K2LRC0603N-M  [RC0603N-M]
R128  4.7k  RC0603JR-074K7LRC0603N-M  [RC0603N-M]
R129  100R  RC0603JR-07100RLRC0603N-M  [RC0603N-M]
R130  100R  RC0603JR-07100RLRC0603N-M  [RC0603N-M]
R131  10k  RC0603JR-0710KLRC0603N-M  [RC0603N-M]
R132  2.2k  RC0603JR-072K2LRC0603N-M  [RC0603N-M]
R133  4.7k  RC0603JR-074K7LRC0603N-M  [RC0603N-M]
R134  100R  RC0603JR-07100RLRC0603N-M  [RC0603N-M]
R135  100R  RC0603JR-07100RLRC0603N-M  [RC0603N-M]
R136  47k  RC0603JR-0747KLRC0603N-M  [RC0603N-M]
R137  47k  RC0603JR-0747KLRC0603N-M  [RC0603N-M]
R138  47k  RC0603JR-0747KLRC0603N-M  [RC0603N-M]
R139  47k  RC0603JR-0747KLRC0603N-M  [RC0603N-M]
R140  47k  RC0603JR-0747KLRC0603N-M  [RC0603N-M]
R141  4.7k  RC0603JR-074K7LRC0603N-M  [RC0603N-M]
R142  4.7k  RC0603JR-074K7LRC0603N-M  [RC0603N-M]
R143  4.7k  RC0603JR-074K7LRC0603N-M  [RC0603N-M]
R144  10k  RC0603JR-0710KLRC0603N-M  [RC0603N-M]
R145  10k  RC0603JR-0710KLRC0603N-M  [RC0603N-M]
U11  MEGA8-AI  [TQFP32-08]
X5  16MHz  CSTCE16  [3-SMD]

### Nets
+5V: C43.2 C73.1 C75.2 R120.2 U11.4(VCC) U11.6(VCC) U11.18(AVCC) ; also sheet 1,2,3,4,6
A_SENSE4: R137.1 R140.2 R141.1 U11.24(PC1(ADC1))
AHIN4: R122.2 U11.27(PC4(ADC4/SDA))
ALIN4: R119.1 R125.2 U11.30(PD0(RXD))
AOUT4: C39.2 Q38.3(S) Q39.2(D) R140.1
B_SENSE4: R136.1 R139.2 R142.1 U11.23(PC0(ADC0))
BHIN4: R128.2 U11.31(PD1(TXD))
BLIN4: R126.1 R130.2 U11.28(PC5(ADC5/SCL))
BOUT4: C40.2 Q41.3(S) Q42.2(D) R139.1
C_SENSE4: R123.1 R138.2 R143.1 U11.22(ADC7)
CHIN4: R133.2 U11.1(PD3(INT1))
CLIN4: R131.1 R135.2 U11.9(PD5(T1))
COUT4: C41.2 Q44.3(S) Q45.2(D) R138.1
GND: C42.1 C43.1 C73.2 C74.2 C75.1 JP5.2 Q37.2(E) Q39.3(S) Q40.2(E) Q42.3(S) Q43.2(E) Q45.3(S) R119.2 R126.2 R131.2 R141.2 R142.2 R143.2 R145.2 U11.3(GND) U11.5(GND) U11.21(GND) X5.2(GND) ; also sheet 1,2,3,4,6
MISO4: U11.16(PB4(MISO)) ; also sheet 1
MOSI4: U11.15(PB3(MOSI/OC2)) ; also sheet 1
N$103: Q37.1(B) R122.1
N$104: Q38.1(G) R124.1
N$105: Q37.3(C) R121.2 R124.2
N$106: C39.1 D10.C R121.1
N$107: Q39.1(G) R125.1
N$108: Q40.1(B) R128.1
N$109: Q41.1(G) R129.1
N$110: Q40.3(C) R127.2 R129.2
N$111: C40.1 D11.C R127.1
N$112: Q42.1(G) R130.1
N$113: Q43.1(B) R133.1
N$114: Q44.1(G) R134.1
N$115: Q43.3(C) R132.2 R134.2
N$116: C41.1 D12.C R132.1
N$117: Q45.1(G) R135.1
N$118: R144.2 U11.12(PB0(ICP))
N$119: JP5.1 U11.19(ADC6)
N$120: C42.2 U11.20(AREF)
N$121: U11.7(PB6(XTAL1/TOSC1)) X5.3
N$122: U11.8(PB7(XTAL2/TOSC2)) X5.1
NEUTRAL_SENSE4: R123.2 R136.2 R137.2 U11.10(PD6(AIN0))
PWM4: R144.1 R145.1 ; also sheet 1
RST4: C74.1 R120.1 U11.29(PC6(/RESET)) ; also sheet 1
SCK4: U11.17(PB5(SCK)) ; also sheet 1
VDD: D10.A D11.A D12.A Q38.2(D) Q41.2(D) Q44.2(D) ; also sheet 1,2,3,4,6
Unconnected: U11.2(PD4(XCK/T0)) U11.11(PD7(AIN1)) U11.13(PB1(OC1A)) U11.14(PB2(SS/OC1B)) U11.25(PC2(ADC2)) U11.26(PC3(ADC3)) U11.32(PD2(INT0))

### Notes on the sheet
- ESC4

## Sheet 6 of 6: Power Supplies
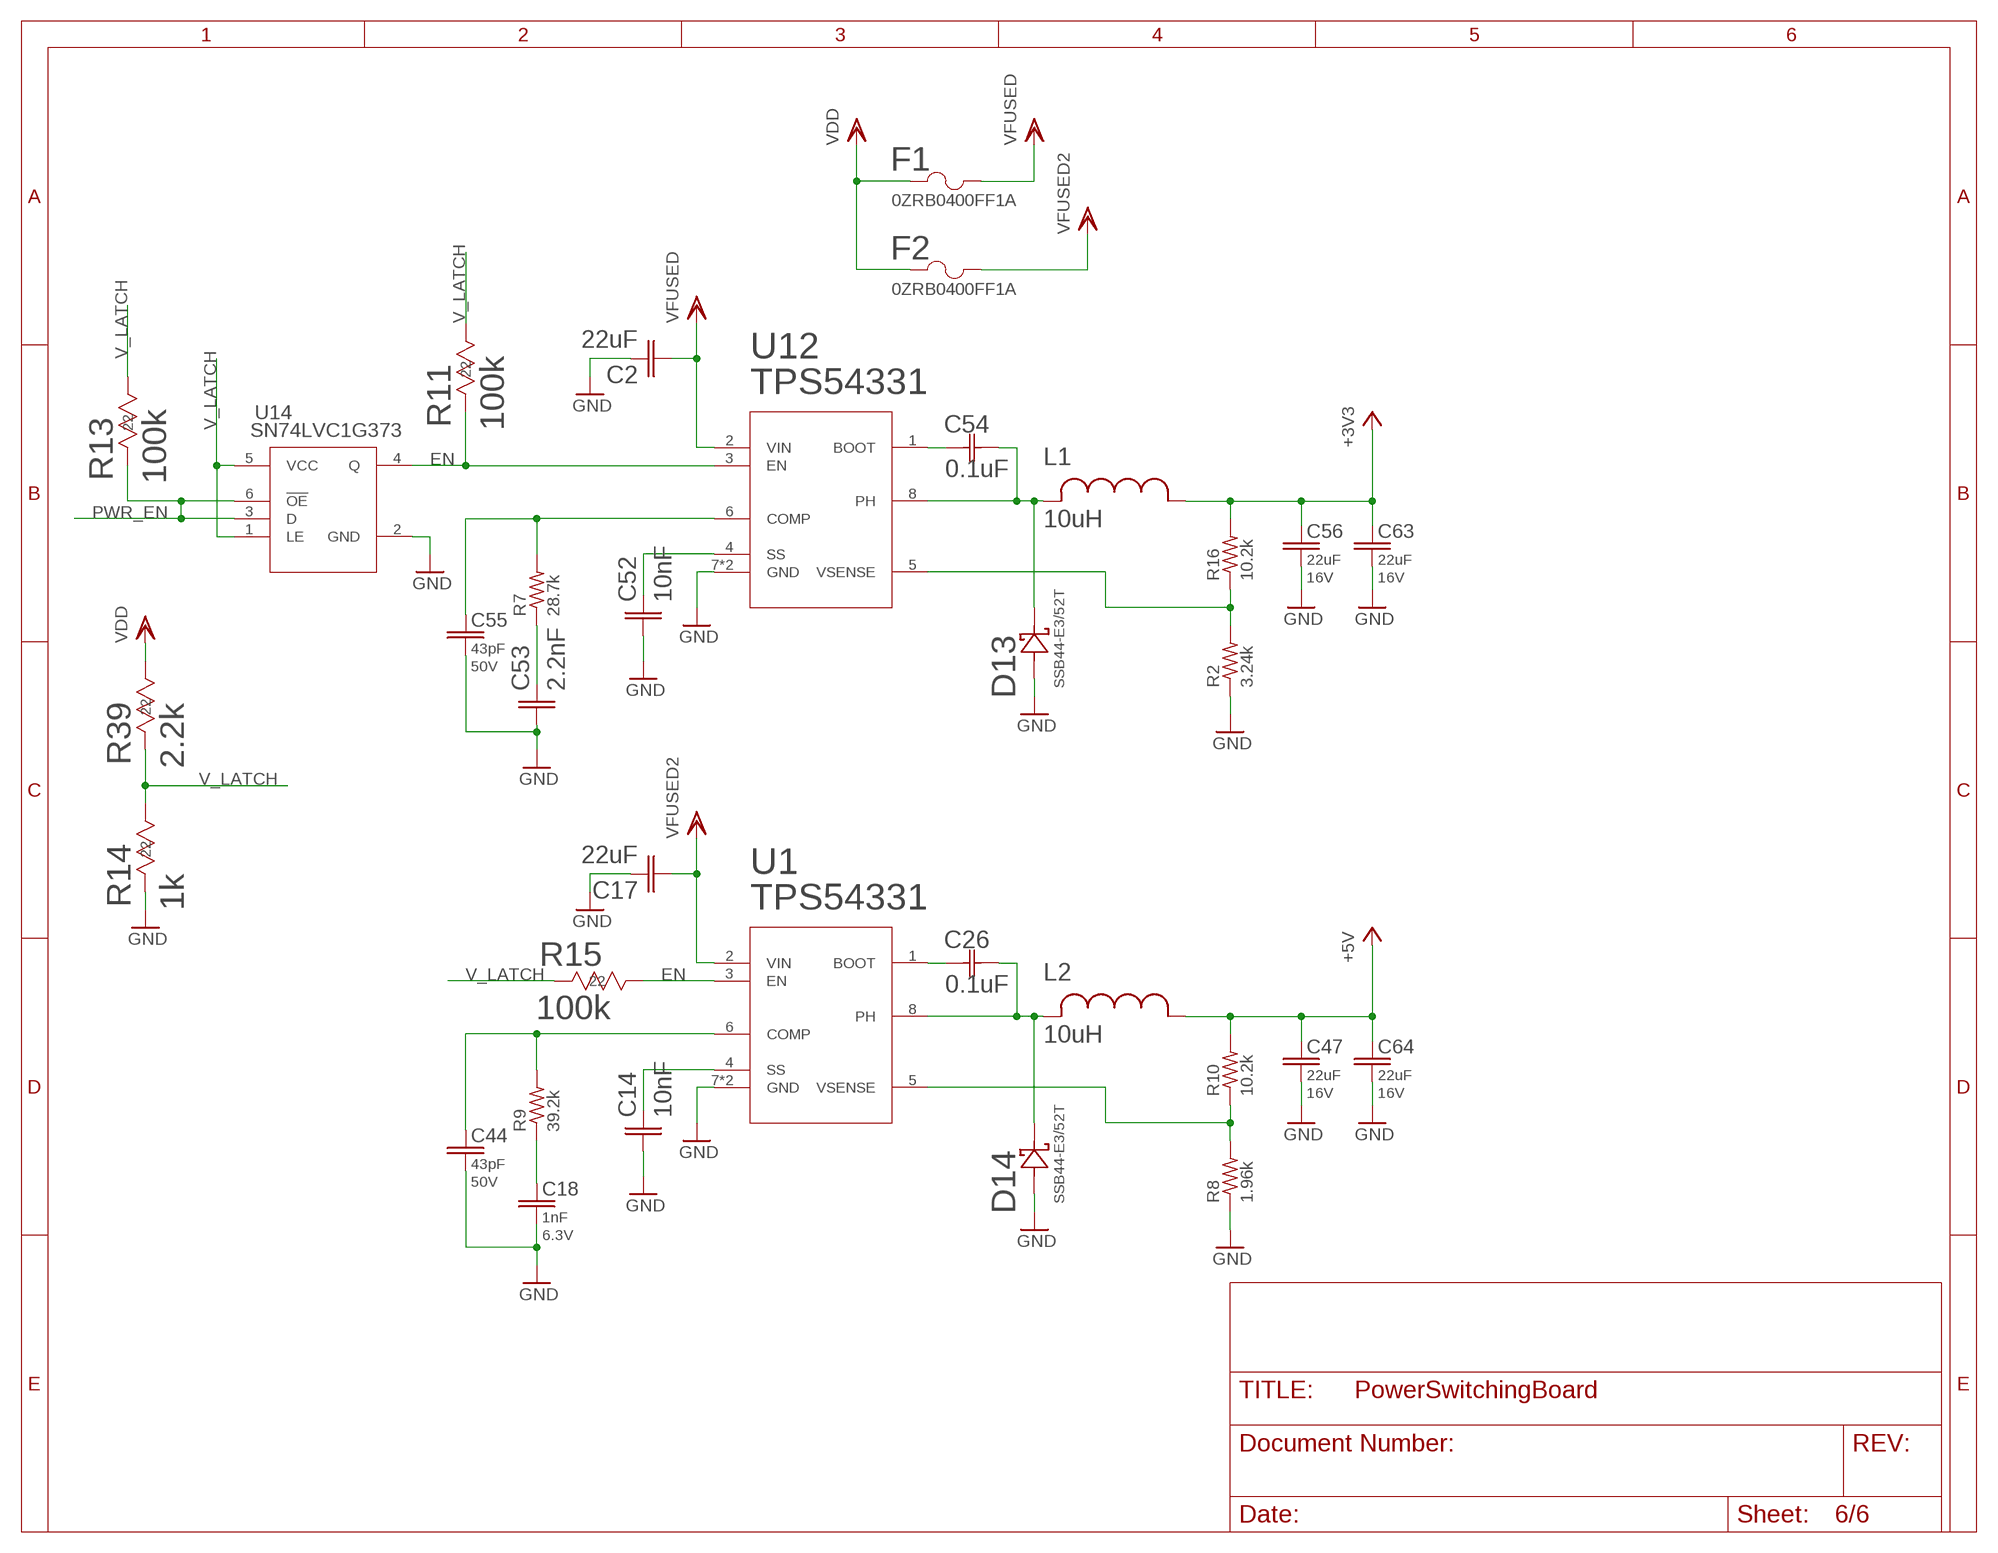
[diagram p5: schematic, sheet 6]

### Parts
C2  22uF  CL32A226MAJNNNE  [1210_CAPACITOR]
C14  10nF  10NF_CAPACITOR  [0603_CAPACITOR]
C17  22uF  CL32A226MAJNNNE  [1210_CAPACITOR]
C18  1nF  GRM155R60J102KA01D  [C0402]
C26  0.1uF  0402ZD104KAT2A0402-M  [0402-M]
C44  43pF  CL10C430JB8NNNC  [C0603]
C47  22uF  CL21A226MOCLRNC  [C0805]
C52  10nF  10NF_CAPACITOR  [0603_CAPACITOR]
C53  2.2nF  2200PF_CAPACITOR  [0402_CAPACITOR]
C54  0.1uF  0402ZD104KAT2A0402-M  [0402-M]
C55  43pF  CL10C430JB8NNNC  [C0603]
C56  22uF  CL21A226MOCLRNC  [C0805]
C63  22uF  CL21A226MOCLRNC  [C0805]
C64  22uF  CL21A226MOCLRNC  [C0805]
D13  SSB44-E3/52T  SSB44-E3/52TDIODE_DO214AA_MBRS-M  [DIODE_DO214AA_MBRS-M]
D14  SSB44-E3/52T  SSB44-E3/52TDIODE_DO214AA_MBRS-M  [DIODE_DO214AA_MBRS-M]
F1  0ZRB0400FF1A  [0ZRB0400FF1A]
F2  0ZRB0400FF1A  [0ZRB0400FF1A]
L1  10uH  PA4341.103  [PA431.XXX]
L2  10uH  PA4341.103  [PA431.XXX]
R2  3.24k  RMCF0603FT3K24  [R0603]
R7  28.7k  RC0402FR-0728K7L  [R0402]
R8  1.96k  RC0603FR-071K96L  [R0603]
R9  39.2k  RC0402FR-0739K2L  [R0402]
R10  10.2k  RC0402FR-0710K2L  [R0402]
R11  100k  RC0603JR-07100KLRC0603N-M  [RC0603N-M]
R13  100k  RC0603JR-07100KLRC0603N-M  [RC0603N-M]
R14  1k  RC0603JR-071KLRC0603N-M  [RC0603N-M]
R15  100k  RC0603JR-07100KLRC0603N-M  [RC0603N-M]
R16  10.2k  RC0402FR-0710K2L  [R0402]
R39  2.2k  RC0603JR-072K2LRC0603N-M  [RC0603N-M]
U1  TPS54331DRD8-M  [D8-M]
U12  TPS54331DRD8-M  [D8-M]
U14  SN74LVC1G373DCKRDCK6-M  [DCK6-M]

### Nets
+3V3: C56.1 C63.1 L1.P$2 R16.2 ; also sheet 1
+5V: C47.1 C64.1 L2.P$2 R10.2 ; also sheet 1,2,3,4,5
EN: R11.2 R15.1 U1.3(EN) U12.3(EN) U14.4(Q)
GND: C2.2 C14.1 C17.2 C18.2 C44.2 C47.2 C52.1 C53.1 C55.2 C56.2 C63.2 C64.2 D13.2 D14.2 R2.1 R8.1 R14.2 U1.7(GND) U1.EP(GND) U12.7(GND) U12.EP(GND) U14.2(GND) ; also sheet 1,2,3,4,5
N$2: C55.1 R7.2 U12.6(COMP)
N$3: C53.2 R7.1
N$11: C52.2 U12.4(SS)
N$12: C54.1 U12.1(BOOT)
N$13: C44.1 R9.2 U1.6(COMP)
N$14: C18.1 R9.1
N$15: C14.2 U1.4(SS)
N$16: C26.1 U1.1(BOOT)
N$17: C26.2 D14.1 L2.P$1 U1.8(PH)
N$18: C54.2 D13.1 L1.P$1 U12.8(PH)
N$19: R8.2 R10.1 U1.5(VSENSE)
N$20: R2.2 R16.1 U12.5(VSENSE)
PWR_EN: R13.2 U14.3(D) U14.6(!OE) ; also sheet 1
V2FUSED: C17.1 F2.2 U1.2(VIN) ; supply symbol labelled VFUSED2
V_LATCH: R11.1 R13.1 R14.1 R15.2 R39.2 U14.1(LE) U14.5(VCC)
VDD: F1.1 F2.1 R39.1 ; also sheet 1,2,3,4,5
VFUSED: C2.1 F1.2 U12.2(VIN)

## Library data of the parts
C1 C3-C5 C12 C26 C28-C31 C33-C36 C38-C42 C46 C49 C51 C54 C62 C65-C75 = 0.1uF-capacitor-0402:0402ZD104KAT2A; MANUFACTURER_PART_NUMBER: 0402ZD104KAT2A; VENDOR: AVX Corporation
C2 C8 C13 C15-C17 C19-C25 C48 C57-C61 = thanics_robotics:CL32A226MAJNNNE
C6 C10 = 470uF-capacitor:UWT1E471MNL1GS; MANUFACTURER_PART_NUMBER: UWT1E471MNL1GS; VENDOR: Nichicon
C7 C32 C37 C43 C50 = 2.2uF X5R Capacitor:GRM188R61C225KE15J; COPYRIGHT: Copyright C 2015 Accelerated Designs. All rights reserved; MANUFACTURER_PART_NUMBER: GRM188R61C225KE15J; VENDOR: Vendor
C9 = 10uF X5R Ceramic Capacitor:GRM21BR60J106ME19L; COPYRIGHT: Copyright C 2015 Accelerated Designs. All rights reserved; MANUFACTURER_PART_NUMBER: GRM21BR60J106ME19L; VENDOR: Vendor
C11 C14 C27 C45 C52 = thanics_robotics:10NF_CAPACITOR
C18 = thanics-capacitor:GRM155R60J102KA01D; RATING: 6.3V
C44 C55 = thanics-capacitor:CL10C430JB8NNNC; RATING: 50V
C47 C56 C63 C64 = thanics-capacitor:CL21A226MOCLRNC; RATING: 16V
C53 = thanics_robotics:2200PF_CAPACITOR
D1-D12 = 1n4148w-diode:1N4148W-7-F; COPYRIGHT: Copyright C 2015 Accelerated Designs. All rights reserved; MANUFACTURER_PART_NUMBER: 1N4148W7F; VENDOR: Diodes Inc
D13 D14 = ssb44-schottky:SSB44-E3/52T; MANUFACTURER_PART_NUMBER: SSB44E352T; VENDOR: Vishay
F1 F2 = ptc-fuse:0ZRB0400FF1A
GND SCL SDA = testpad:TP: Test pad
J1 = thanics_robotics:ESC_CONTACTS
J2 = thanics_robotics:JST_SH_4POS
J3 = 30pin_ffc_connector:62674-301121ALF; MANUFACTURER_PART_NUMBER: 62674301121ALF; VENDOR: FCI
J4-J6 = jst:B3B-ZR-SM4
JP1 JP3-JP5 = SparkFun-Jumpers:JUMPER-SMT_2_NO: Normally open jumper This jumper has two pads in close proximity to each other. Apply solder to close the connection. Round pads are easier to solder for beginners, but are a lot larger. SparkFun Product that uses the round pads: SparkFun EL Sequencer <https://www.sparkfun.com/products/12781>
L1 L2 = thanics_robotics:PA4341.103
Q1-Q3 Q19 Q22 Q25 Q28 Q31 Q34 Q37 Q40 Q43 = SparkFun-DiscreteSemi:TRANS_NPN: NPN transistor Current controlled devices typically used to amplify current or used as a switch. BC547 - COM-08928 <http://www.sparkfun.com/products/8928> (TO-92 45V 100mA) (1.Collector 2.Base 3.Emitter) 2N3904 - COM-00521 <http://www.sparkfun.com/products/521> (TO-92 40V 200mA) (1.Emitter 2.Base 3.Collector) P2N2222A - COM-12852 <http://www.sparkfun.com/products/12852> (TO-92 40V 600mA) (1.Collector 2.Base 3.Emitter); PROD_ID: TRANS-09116
Q4-Q9 Q20 Q21 Q23 Q24 Q26 Q27 Q29 Q30 Q32 Q33 Q35 Q36 Q38 Q39 Q41 Q42 Q44 Q45 = thanics_robotics:IRLR8726
R1 R3 R12 R19 R24 R37 R38 R40 R65 R66 R72 R77 R90-R93 R99 R104 R117-R120 R126 R131 R144 R145 = 10k-resistor(0603):RC0603JR-0710KL; MANUFACTURER_PART_NUMBER: RC0603JR0710KL; VENDOR: Yageo
R2 = thanics-resistor:RMCF0603FT3K24
R4 R20 R25 R39 R67 R73 R78 R94 R100 R105 R121 R127 R132 = 2.2k-resistor:RC0603JR-072K2L; MANUFACTURER_PART_NUMBER: RC0603JR072K2L; VENDOR: Yageo
R5 R21 R26 R34-R36 R68 R74 R79 R87-R89 R95 R101 R106 R114-R116 R122 R128 R133 R141-R143 = 4.7k-resistor:RC0603JR-074K7L; MANUFACTURER_PART_NUMBER: RC0603JR074K7L; VENDOR: Yageo
R6 R29-R33 R69 R82-R86 R96 R109-R113 R123 R136-R140 = 47k-resistor:RC0603JR-0747KL; MANUFACTURER_PART_NUMBER: RC0603JR0747KL; VENDOR: Yageo
R7 = thanics-resistor:RC0402FR-0728K7L
R8 = thanics-resistor:RC0603FR-071K96L
R9 = thanics-resistor:RC0402FR-0739K2L
R10 R16 = thanics-resistor:RC0402FR-0710K2L
R11 R13 R15 = 100k-resistor:RC0603JR-07100KL; MANUFACTURER_PART_NUMBER: RC0603JR07100KL; VENDOR: Yageo
R14 = 1k-resistor:RC0603JR-071KL; CASE: 0603 1608 metric; COMPOSITION: Thick Film; COPYRIGHT: Copyright C 2015 Accelerated Designs. All rights reserved; DATASHEET: httpwww.yageo.comdocumentsrecentPYuRC0603_51_RoHS_L_4.pdf; DESCRIPTION: RES 1.0K OHM 110W 5% 0603 SMD; DIGIKEYPARTNUMBER: 3111.0KGRTRND; HEIGHT: 0.022" 0.55mm; LEADSTYLE: Surface Mount SMD SMT; MANUFACTURER_PART_NUMBER: RC0603JR071KL; NEWARKPARTNUMBER: 14M7231; NUMBEROFTERMINATIONS: 2; PACKAGECASE: 0603 1608 Metric; PACKAGING: Tape &amp Reel TR; POWERWATTS: 0.1W 110W; QUANTITY_AVAILABLE: 0; RESISTANCEINOHMS: 1.00K; RESISTANCEOHMS: 1K; SIZEDIMENSION: 0.063" L x 0.031" W 1.60mm x 0.80mm; TEMPERATURECOEFFICIENT: 100ppm°C; TOLERANCE: 5%; VENDOR: Yageo; VOLTAGEWORKING: 50V
R17 R18 R22 R23 R27 R28 R70 R71 R75 R76 R80 R81 R97 R98 R102 R103 R107 R108 R124 R125 R129 R130 R134 R135 = 100-resistor:RC0603JR-07100RL; MANUFACTURER_PART_NUMBER: RC0603JR07100RL; VENDOR: Yageo
R41 = 1.5k-resistor:RC0603JR-071K5L; MANUFACTURER_PART_NUMBER: RC0603JR071K5L; VENDOR: Yageo
U1 U12 = tps54331:TPS54331DR; MANUFACTURER_PART_NUMBER: TPS54331DR; VENDOR: Texas Instruments
U2 U3 = thanics_robotics:74HC4052
U4-U6 = DRV8313_BLDC_Driver:DRV8313PWPR; MANUFACTURER_PART_NUMBER: drv8313pwp; VENDOR: TEXAS INSTRUMENTS
U7 = stm32f103:STM32F103RCT6; MANUFACTURER_PART_NUMBER: STM32F103RCT6; VENDOR: STMicroelectronics
U8-U11 = atmel:MEGA8: MICROCONTROLLER 8 Kbytes FLASH, 1 kbytes SRAM, 512 bytes EEPROM, USART, 6-channel 10 bit ADC, 2-channel 8 bit ADC Pin compatible with Atmega48, ATMega88, ATMega168 Source: avr.lbr; MPN: ATMEGA8-16AU; OC_FARNELL: 9171371; OC_NEWARK: 73M8863
U14 = d-latch:SN74LVC1G373DCKR; MANUFACTURER_PART_NUMBER: SN74LVC1G373DCKR; VENDOR: Texas Instruments
X1 X3-X5 = thanics_robotics:CSTCE16
X6 = thanics_robotics:CSTCE8M00G55